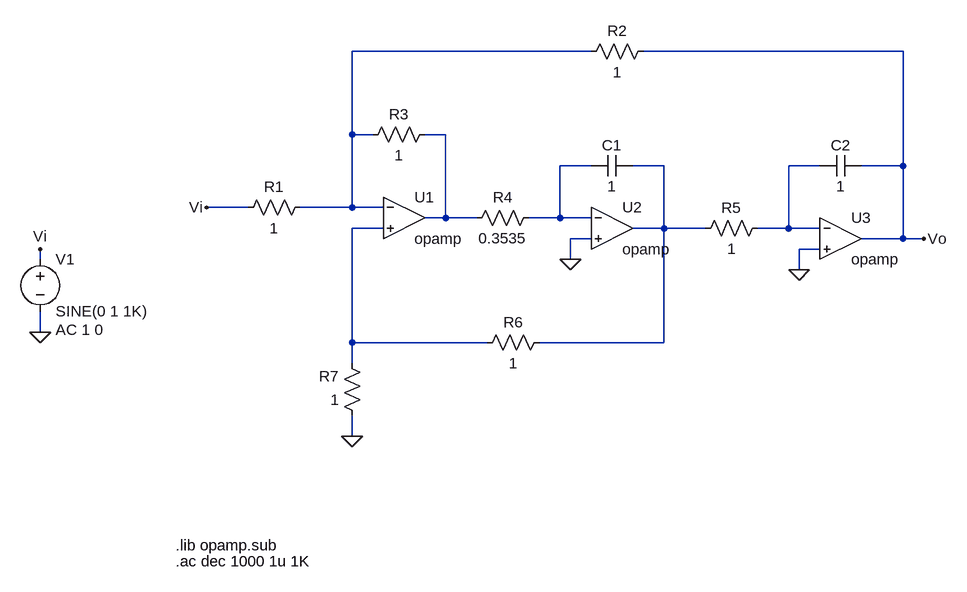
[diagram p0: schematic khn_normalizado.asc]
khn_normalizado.asc, the LTspice schematic file:
Version 4.1
SHEET 1 1092 704
WIRE 496 -96 128 -96
WIRE 976 -96 576 -96
WIRE 128 32 128 -96
WIRE 160 32 128 32
WIRE 272 32 240 32
WIRE 496 80 448 80
WIRE 608 80 560 80
WIRE 848 80 800 80
WIRE 976 80 976 -96
WIRE 976 80 912 80
WIRE -32 144 -96 144
WIRE 128 144 128 32
WIRE 128 144 48 144
WIRE 176 144 128 144
WIRE 272 160 272 32
WIRE 272 160 240 160
WIRE 320 160 272 160
WIRE 448 160 448 80
WIRE 448 160 400 160
WIRE 496 160 448 160
WIRE 176 176 128 176
WIRE 608 176 608 80
WIRE 608 176 560 176
WIRE 672 176 608 176
WIRE 800 176 800 80
WIRE 800 176 752 176
WIRE 848 176 800 176
WIRE 496 192 464 192
WIRE 976 192 976 80
WIRE 976 192 912 192
WIRE 1008 192 976 192
WIRE 848 208 816 208
WIRE -352 224 -352 208
WIRE 464 224 464 192
WIRE 816 240 816 208
WIRE -352 336 -352 304
WIRE 128 352 128 176
WIRE 336 352 128 352
WIRE 608 352 608 176
WIRE 608 352 416 352
WIRE 128 384 128 352
WIRE 128 496 128 464
FLAG 128 496 0
FLAG 464 224 0
FLAG 816 240 0
FLAG -96 144 Vi
FLAG 1008 192 Vo
FLAG -352 336 0
FLAG -352 208 Vi
SYMBOL res 64 128 R90
WINDOW 0 0 56 VBottom 2
WINDOW 3 32 56 VTop 2
SYMATTR InstName R1
SYMATTR Value 1
SYMBOL res 592 -112 R90
WINDOW 0 0 56 VBottom 2
WINDOW 3 32 56 VTop 2
SYMATTR InstName R2
SYMATTR Value 1
SYMBOL OpAmps\\opamp 208 96 R0
SYMATTR InstName U1
SYMBOL OpAmps\\opamp 528 112 R0
SYMATTR InstName U2
SYMBOL OpAmps\\opamp 880 128 R0
SYMATTR InstName U3
SYMBOL res 256 16 R90
WINDOW 0 0 56 VBottom 2
WINDOW 3 32 56 VTop 2
SYMATTR InstName R3
SYMATTR Value 1
SYMBOL res 416 144 R90
WINDOW 0 0 56 VBottom 2
WINDOW 3 32 56 VTop 2
SYMATTR InstName R4
SYMATTR Value 0.3535
SYMBOL res 768 160 R90
WINDOW 0 0 56 VBottom 2
WINDOW 3 32 56 VTop 2
SYMATTR InstName R5
SYMATTR Value 1
SYMBOL res 432 336 R90
WINDOW 0 0 56 VBottom 2
WINDOW 3 32 56 VTop 2
SYMATTR InstName R6
SYMATTR Value 1
SYMBOL res 144 480 R180
WINDOW 0 36 76 Left 2
WINDOW 3 36 40 Left 2
SYMATTR InstName R7
SYMATTR Value 1
SYMBOL cap 560 64 R90
WINDOW 0 0 32 VBottom 2
WINDOW 3 32 32 VTop 2
SYMATTR InstName C1
SYMATTR Value 1
SYMBOL cap 912 64 R90
WINDOW 0 0 32 VBottom 2
WINDOW 3 32 32 VTop 2
SYMATTR InstName C2
SYMATTR Value 1
SYMBOL voltage -352 208 R0
WINDOW 123 24 124 Left 2
WINDOW 39 0 0 Left 0
SYMATTR Value2 AC 1 0
SYMATTR InstName V1
SYMATTR Value SINE(0 1 1K)
TEXT -144 664 Left 2 !.lib opamp.sub
TEXT -144 688 Left 2 !.ac dec 1000 1u 1K

The netlist it stands for:
* khn_normalizado.asc
R1 N001 Vi 1
R2 Vo N001 1
X§U1 N001 N006 N002 opamp Aol=100K GBW=10Meg  ; pins invin noninvin out
X§U2 N003 0 N004 opamp Aol=100K GBW=10Meg  ; pins invin noninvin out
X§U3 N005 0 Vo opamp Aol=100K GBW=10Meg  ; pins invin noninvin out
R3 N002 N001 1
R4 N003 N002 0.3535
R5 N005 N004 1
R6 N004 N006 1
R7 0 N006 1
C1 N004 N003 1
C2 Vo N005 1
V1 Vi 0 SINE(0 1 1K) AC 1 0
.lib opamp.sub
.ac dec 1000 1u 1K
.backanno
.end